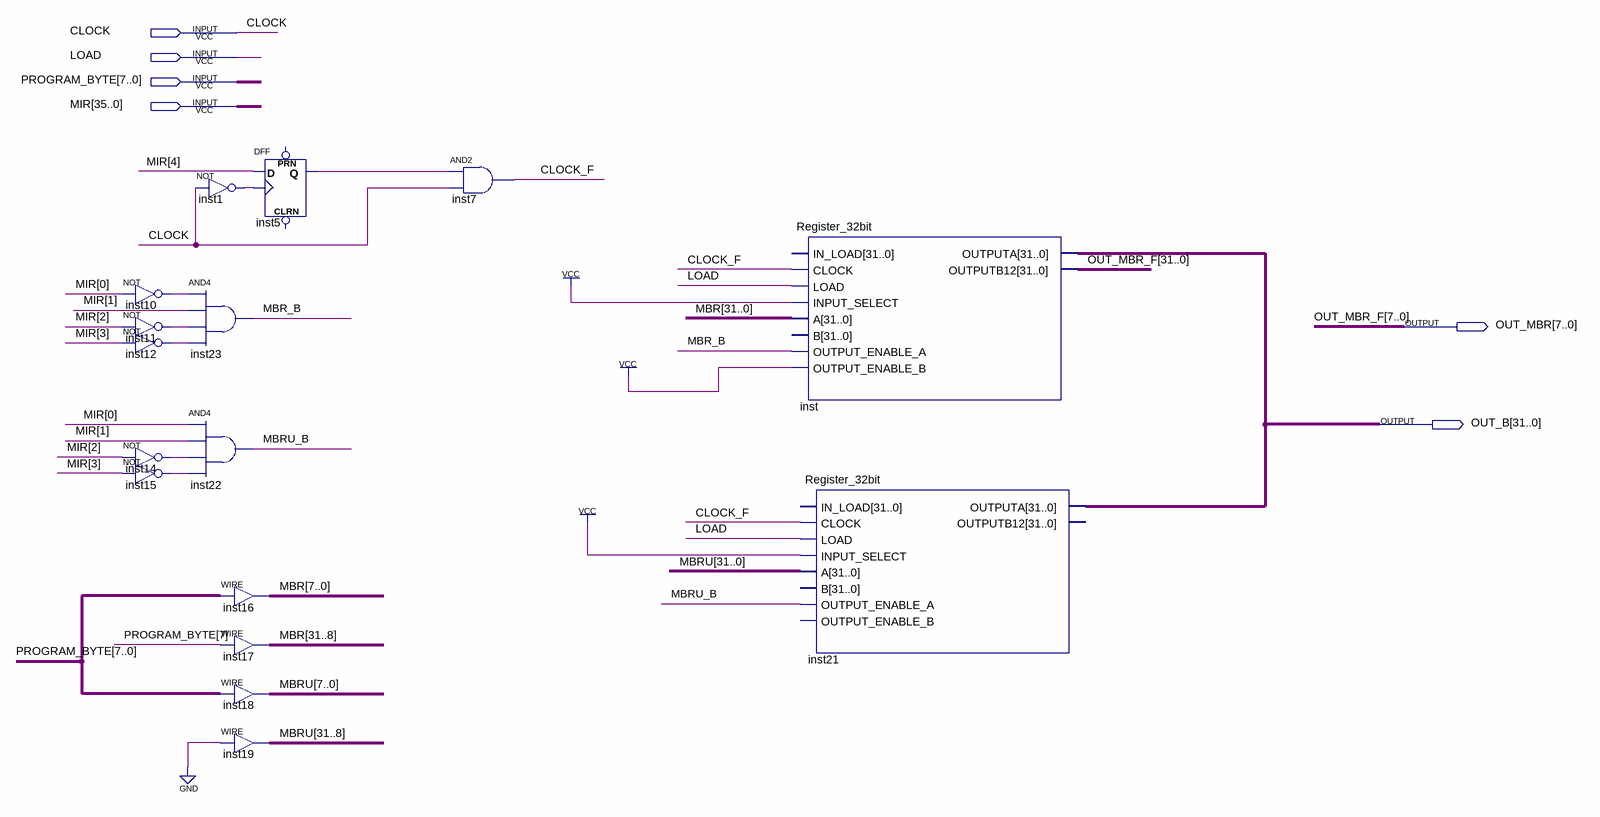
[diagram p0: schematic sheet]
// Quartus schematic MBR.bdf as structural Verilog: 16 symbols, 6 pins
module MBR (
  input  CLOCK,
  input  LOAD,
  input  [7:0] PROGRAM_BYTE,
  input  [35:0] MIR,
  output [7:0] OUT_MBR,
  output [31:0] OUT_B
);

  wire CLOCK_F, inst1_out, inst5_q, inst10_out, inst11_out, inst12_out, inst14_out, inst15_out, MBR_B, MBRU_B;
  wire [31:0] MBR, MBRU;
  wire [31:8] OUT_MBR_F;

  not inst10 (inst10_out, MIR[0]);
  not inst11 (inst11_out, MIR[2]);
  not inst12 (inst12_out, MIR[3]);
  not inst14 (inst14_out, MIR[2]);
  not inst15 (inst15_out, MIR[3]);
  not inst1 (inst1_out, CLOCK);
  and inst23 (MBR_B, inst10_out, MIR[1], inst11_out, inst12_out);
  and inst22 (MBRU_B, MIR[0], MIR[1], inst14_out, inst15_out);
  assign MBR[7:0] = PROGRAM_BYTE;  // WIRE inst16
  assign MBR[31:8] = {24{PROGRAM_BYTE[7]}};  // WIRE inst17
  assign MBRU[7:0] = PROGRAM_BYTE;  // WIRE inst18
  assign MBRU[31:8] = {24{1'b0}};  // WIRE inst19
  DFF inst5 (.CLK(inst1_out), .D(MIR[4]), .Q(inst5_q));  // open: CLRN, PRN
  and inst7 (CLOCK_F, inst5_q, CLOCK);
  Register_32bit inst (
    .CLOCK(CLOCK_F), .LOAD(LOAD), .INPUT_SELECT(1'b1), .A(MBR), .OUTPUT_ENABLE_A(MBR_B),
    .OUTPUT_ENABLE_B(1'b1), .OUTPUTA(OUT_B), .OUTPUTB12({OUT_MBR_F, OUT_MBR}));  // open: IN_LOAD, B
  Register_32bit inst21 (
    .CLOCK(CLOCK_F), .LOAD(LOAD), .INPUT_SELECT(1'b1), .A(MBRU), .OUTPUT_ENABLE_A(MBRU_B), .OUTPUTA(OUT_B));  // open: IN_LOAD, B, OUTPUT_ENABLE_B, OUTPUTB12

  // Other names for the same wires on the sheet: OUT_MBR_F[7:0] = OUT_MBR
endmodule
